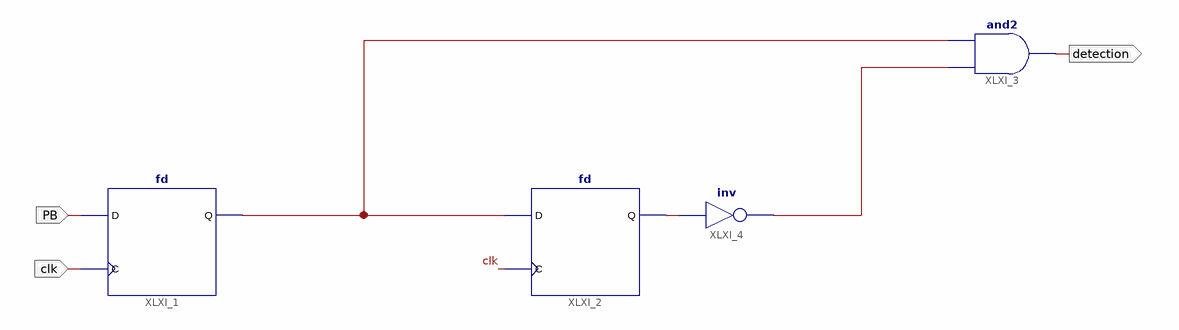
[diagram p0: schematic sheet 1]
// Xilinx ISE schematic EdgeDetector.sch (spartan3e) as structural Verilog: 4 symbols, 3 ports
module EdgeDetector (
  input  PB,
  input  clk,
  output detection
);

  wire XLXN_1, XLXN_2, XLXN_4;

  fd XLXI_1 (.C(clk), .D(PB), .Q(XLXN_4));
  fd XLXI_2 (.C(clk), .D(XLXN_4), .Q(XLXN_1));
  and XLXI_3 (detection, XLXN_2, XLXN_4);
  not XLXI_4 (XLXN_2, XLXN_1);
endmodule
